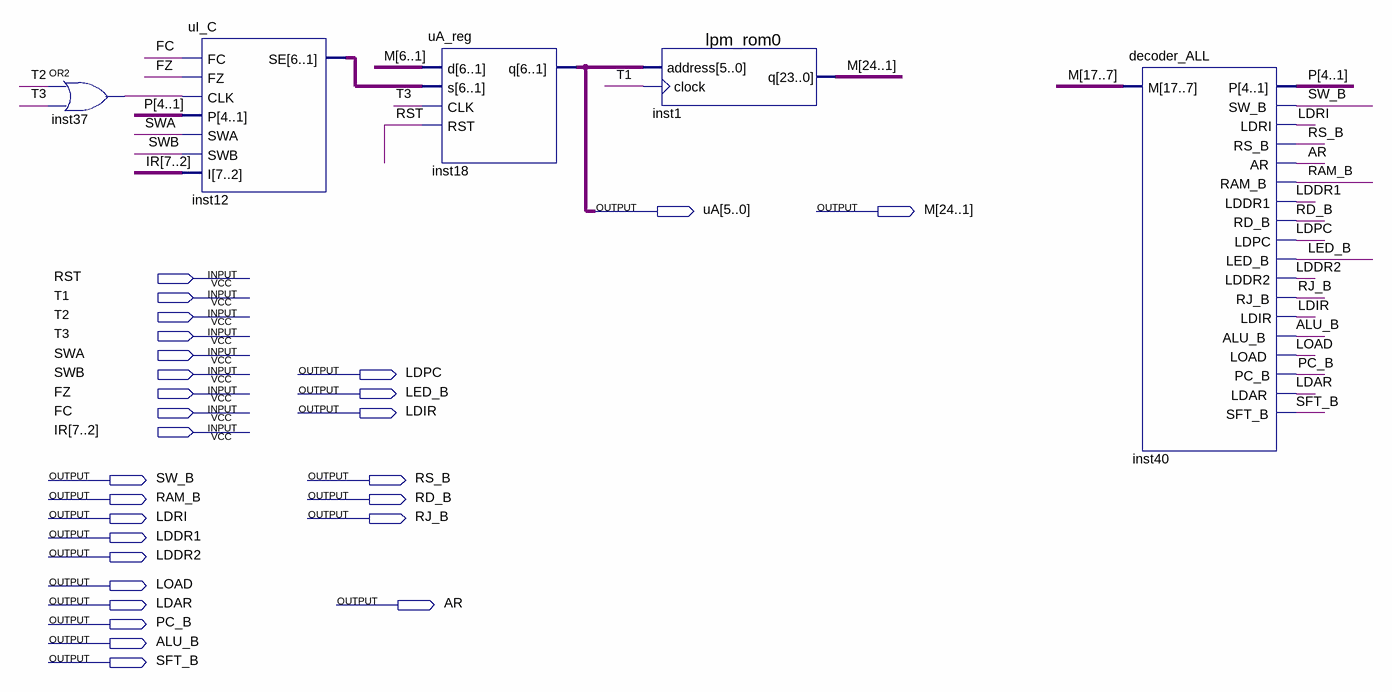
[diagram p0: schematic sheet]
// Quartus schematic uPC.bdf as structural Verilog: 5 symbols, 28 pins
module uPC (
  input  RST,
  input  T1,
  input  T2,
  input  T3,
  input  SWA,
  input  SWB,
  input  FZ,
  input  FC,
  input  [7:2] IR,
  output [5:0] uA,
  output [24:1] M,
  output LDPC,
  output LED_B,
  output LDIR,
  output SW_B,
  output RS_B,
  output RAM_B,
  output RD_B,
  output LDRI,
  output RJ_B,
  output LDDR1,
  output LDDR2,
  output LOAD,
  output LDAR,
  output AR,
  output PC_B,
  output ALU_B,
  output SFT_B
);

  wire inst37_out;
  wire [4:1] P;
  wire [5:0] inst12_se;

  or inst37 (inst37_out, T2, T3);
  uI_C inst12 (.FC(FC), .FZ(FZ), .CLK(inst37_out), .P(P), .SWA(SWA), .SWB(SWB), .I(IR), .SE(inst12_se));
  uA_reg inst18 (.d(M[6:1]), .s(inst12_se), .CLK(T3), .RST(RST), .q(uA));
  lpm_rom0 inst1 (.address(uA), .clock(T1), .q(M));
  decoder_ALL inst40 (
    .M(M[17:7]), .P(P), .SW_B(SW_B), .LDRI(LDRI), .RS_B(RS_B), .AR(AR), .RAM_B(RAM_B), .LDDR1(LDDR1),
    .RD_B(RD_B), .LDPC(LDPC), .LED_B(LED_B), .LDDR2(LDDR2), .RJ_B(RJ_B), .LDIR(LDIR), .ALU_B(ALU_B),
    .LOAD(LOAD), .PC_B(PC_B), .LDAR(LDAR), .SFT_B(SFT_B));
endmodule
